# EasyEDA schematic 1-Schematic_Project Stella.json
TITLE: Mechanism Controller; REV: 1.0; Date: 2019-12-23; Sheet: 1/1; Drawn By: deven2; Company: Team Stella
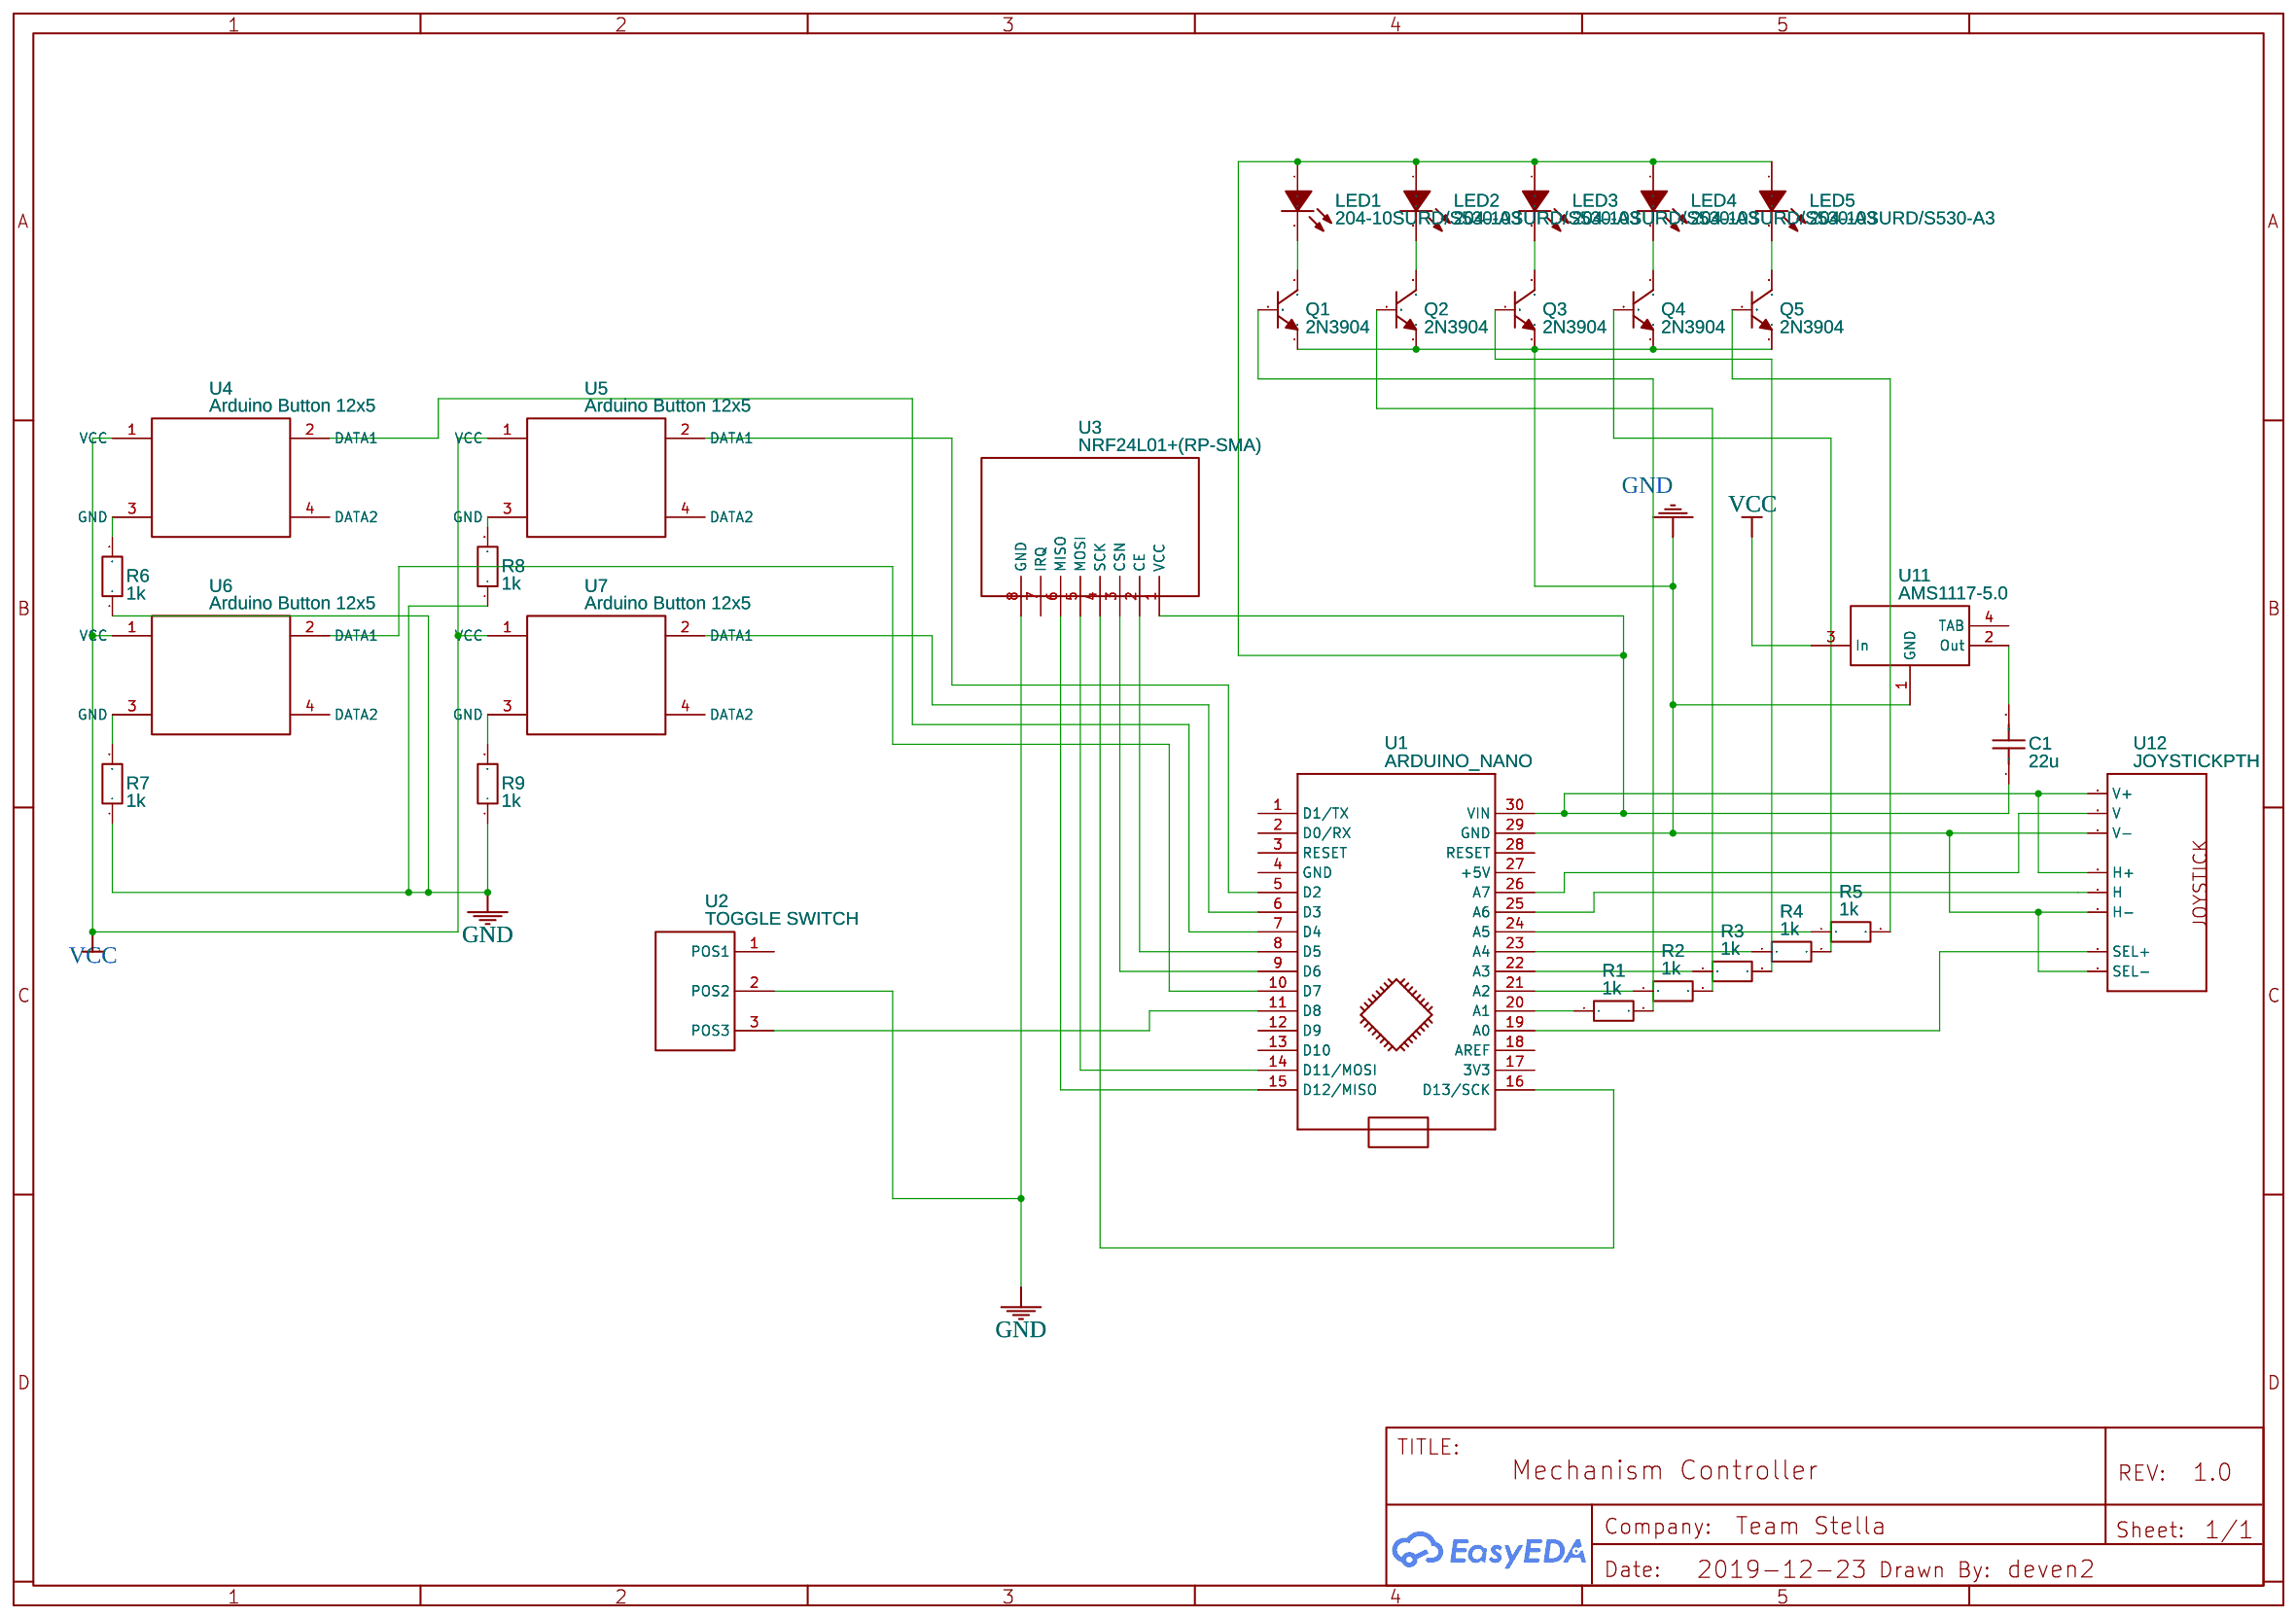
[diagram p0: schematic sheet]

## Parts
C1  22u  [RAD-0.1]
LED1  204-10SURD/S530-A3  [LED-3MM/2.54]
LED2  204-10SURD/S530-A3  [LED-3MM/2.54]
LED3  204-10SURD/S530-A3  [LED-3MM/2.54]
LED4  204-10SURD/S530-A3  [LED-3MM/2.54]
LED5  204-10SURD/S530-A3  [LED-3MM/2.54]
Q1  2N3904  [TO-92-3_L5.1-W4.1-P1.27-L]
Q2  2N3904  [TO-92-3_L5.1-W4.1-P1.27-L]
Q3  2N3904  [TO-92-3_L5.1-W4.1-P1.27-L]
Q4  2N3904  [TO-92-3_L5.1-W4.1-P1.27-L]
Q5  2N3904  [TO-92-3_L5.1-W4.1-P1.27-L]
R1  1k  [AXIAL-0.3]
R2  1k  [AXIAL-0.3]
R3  1k  [AXIAL-0.3]
R4  1k  [AXIAL-0.3]
R5  1k  [AXIAL-0.3]
R6  1k  [AXIAL-0.4]
R7  1k  [AXIAL-0.4]
R8  1k  [AXIAL-0.4]
R9  1k  [AXIAL-0.4]
U1  ARDUINO_NANO  [ARDUINO_NANO]
U2  TOGGLE SWITCH  [TOGGLE SWITCH]
U3  NRF24L01+(RP-SMA)  [NRF24L01+(RP-SMA)]
U4  Arduino Button 12x5  [COLOR BUTTON 12MMX5MM]
U5  Arduino Button 12x5  [COLOR BUTTON 12MMX5MM]
U6  Arduino Button 12x5  [COLOR BUTTON 12MMX5MM]
U7  Arduino Button 12x5  [COLOR BUTTON 12MMX5MM]
U11  AMS1117-5.0  [SOT-223_L6.5-W3.5-P2.30-LS7.0-BR]
U12  JOYSTICKPTH  [JOYSTICK]

## Library data of the parts
C1 = Cap_RAD-0.1_US
LED1-LED5 = 204-10SURD/S530-A3: Supplier: LCSC; Manufacturer: EVERLIGHT; Supplier Part: C99772
Q1-Q5 = 2N3904: Supplier: LCSC; Manufacturer: SEMTECH; Supplier Part: C118538
R1-R5 = Res_AXIAL-0.3(1/8W)_EU
R6-R9 = Res_AXIAL-0.4(1/4W)_EU
U1 = -: sourceId: KGSeAWhDB
U2 = TOGGLE SWITCH: Contributor: Damien_G
U3 = -: Supplier: Sparkfun; Contributor: Damien_G
U4-U7 = -: Contributor: deven2
U11 = -: sourceId: HltLFyQwq; Supplier: LCSC; Manufacturer: AMS; LCSC Assembly: Yes; image: //image.lceda.cn/szlcsc/C6187.jpg; Supplier Part: C6187; SMT Type: Basic
U12 = JOYSTICKPTH: Thumb Joystick; Contributor: SparkFun

## Nets
GND: Q1.1(E) Q2.1(E) Q3.1(E) Q4.1(E) Q5.1(E) R6.1 R7.1 R8.1 R9.1 U1.29(GND) U2.2(POS2) U3.8(GND) U11.1(GND) U12.B2A(SEL-) U12.H3(H-) U12.V3(V-)
VCC: U4.1(VCC) U5.1(VCC) U6.1(VCC) U7.1(VCC) U11.3(In)
Net-(C1-1): C1.1 LED1.1(A) LED2.1(A) LED3.1(A) LED4.1(A) LED5.1(A) U1.30(VIN) U3.1(VCC) U12.H1(H+) U12.V1(V+)
Net-(C1-2): C1.2 U11.2(Out)
Net-(LED1-2): LED1.2(K) Q1.3(C)
Net-(LED2-2): LED2.2(K) Q2.3(C)
Net-(LED3-2): LED3.2(K) Q3.3(C)
Net-(LED4-2): LED4.2(K) Q4.3(C)
Net-(LED5-2): LED5.2(K) Q5.3(C)
Net-(Q1-2): Q1.2(B) R1.2
Net-(Q2-2): Q2.2(B) R2.2
Net-(Q3-2): Q3.2(B) R3.2
Net-(Q4-2): Q4.2(B) R4.2
Net-(Q5-2): Q5.2(B) R5.2
Net-(R1-1): R1.1 U1.20(A1)
Net-(R2-1): R2.1 U1.21(A2)
Net-(R3-1): R3.1 U1.22(A3)
Net-(R4-1): R4.1 U1.23(A4)
Net-(R5-1): R5.1 U1.24(A5)
Net-(R6-2): R6.2 U4.3(GND)
Net-(R7-2): R7.2 U6.3(GND)
Net-(R8-2): R8.2 U5.3(GND)
Net-(R9-2): R9.2 U7.3(GND)
Net-(U1-5): U1.5(D2) U5.2(DATA1)
Net-(U1-6): U1.6(D3) U7.2(DATA1)
Net-(U1-7): U1.7(D4) U4.2(DATA1)
Net-(U1-8): U1.8(D5) U3.2(CE)
Net-(U1-9): U1.9(D6) U3.3(CSN)
Net-(U1-10): U1.10(D7) U6.2(DATA1)
Net-(U1-11): U1.11(D8) U2.3(POS3)
Net-(U1-14): U1.14(D11/MOSI) U3.5(MOSI)
Net-(U1-15): U1.15(D12/MISO) U3.6(MISO)
Net-(U1-16): U1.16(D13/SCK) U3.4(SCK)
Net-(U1-19): U1.19(A0) U12.B1A(SEL+)
Net-(U1-25): U1.25(A6) U12.H2(H)
Net-(U1-26): U1.26(A7) U12.V2(V)

Not connected (* = marked no-connect by the designer): U1 1(D1/TX) 2(D0/RX) 3(RESET) 4(GND) 12(D9) 13(D10) 17(3V3) 18(AREF) 27(+5V) 28(RESET); U2 1(POS1); U3 7(IRQ); U4 4(DATA2); U5 4(DATA2); U6 4(DATA2); U7 4(DATA2); U11 4(TAB)
